# Altium schematic sheet Sheet1.SchDoc
size A4
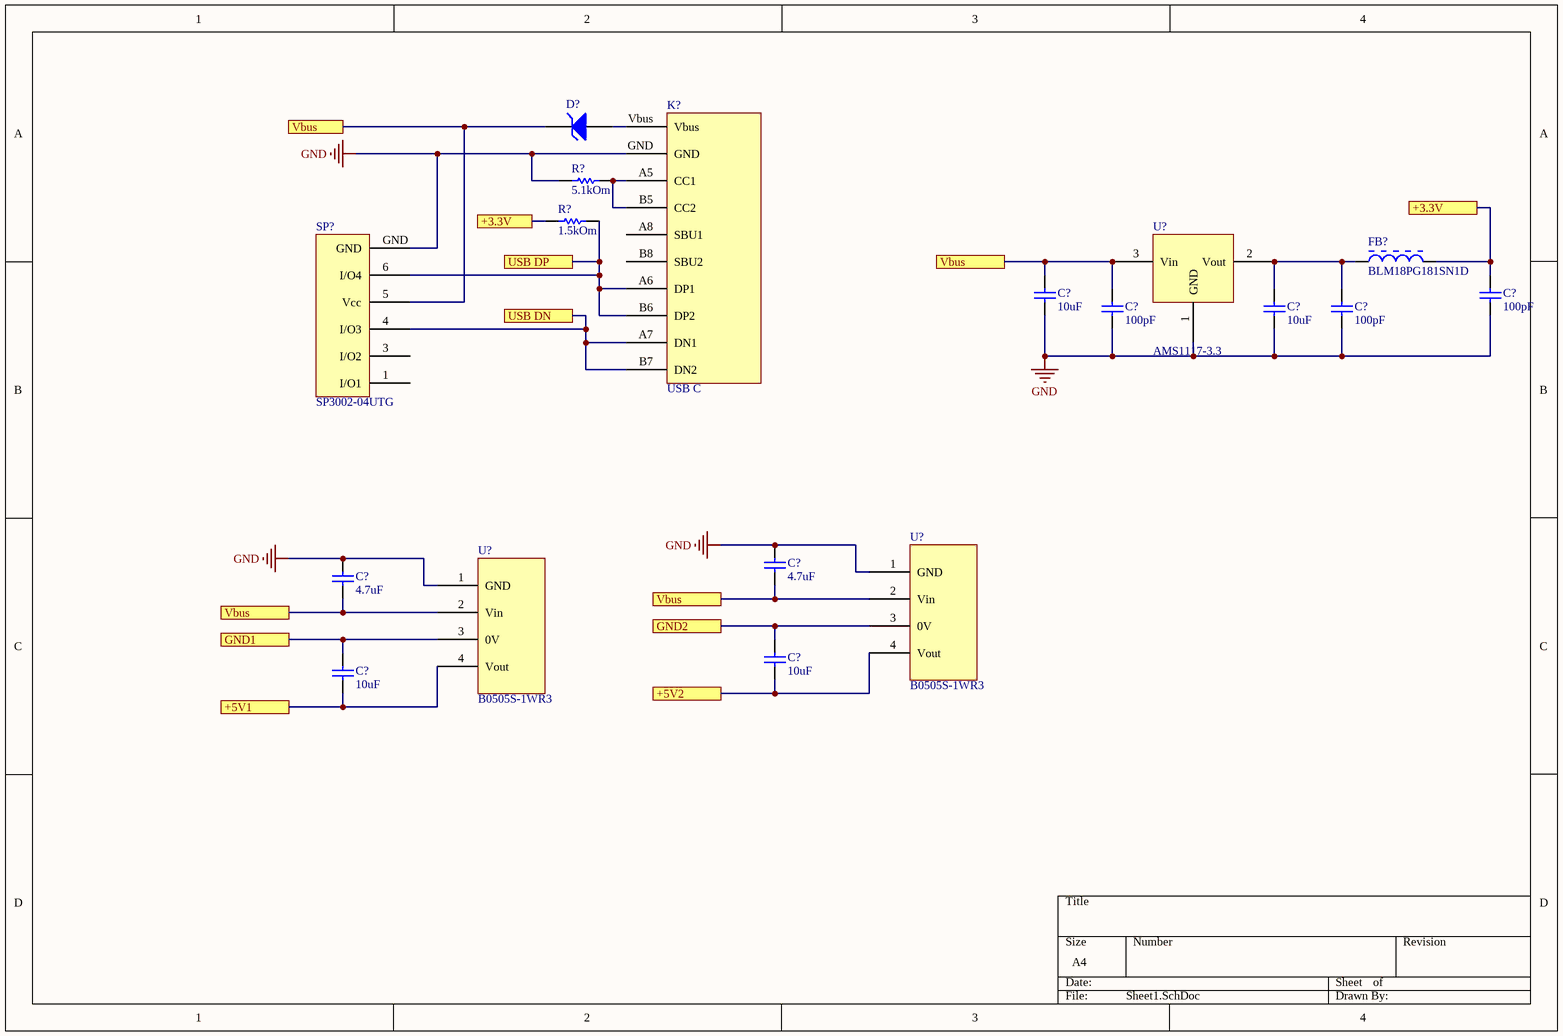
[diagram p0: Sheet1.SchDoc]

## Parts
(Parts that share a designator on the sheet are numbered #1, #2 ... from top to bottom, then left to right.)
C?#1  10uF  [CAPC1608X90X35ML10T15]
C?#2  100pF  [CAPC1608X90X35ML10T15]
C?#3  100pF  [CAPC1608X90X35ML10T15]
C?#4  10uF  [CAPC1608X90X35ML10T15]
C?#5  100pF  [CAPC1608X90X35ML10T15]
C?#6  4.7uF  [CAPC1608X90X35ML10T15]
C?#7  4.7uF  [CAPC1608X90X35ML10T15]
C?#8  10uF  [CAPC1608X90X35ML10T15]
C?#9  10uF  [CAPC1608X90X35ML10T15]
D?  (no value)  [TECO-0603_V]
FB?  BLM18PG181SN1D  [MURA-BLM18PG_KG-CHIP-2_V2]
K?  USB C  [USB type C]
R?#1  5.1kOm  [RESC1608X55X30ML20T10]
R?#2  1.5kOm  [RESC1608X55X30ML20T10]
SP?  SP3002-04UTG  [uDFN-6]
U?#1  AMS1117-3.3  [AMS1117]
U?#2  B0505S-1WR3  [Dip4 package]
U?#3  B0505S-1WR3  [Dip4 package]

## Ports
+3.3V, +5V1, +5V2, GND1, GND2, USB DN, USB DP, Vbus

## Nets
GND: C?#1.1 C?#2.1 C?#3.1 C?#4.1 C?#5.1 C?#6.2 C?#7.2 K?.GND R?#1.1 SP?.GND U?#1.1(GND) U?#2.1(GND) U?#3.1(GND)
+3.3V: C?#2.2 FB?.2 R?#2.1 ; port +3.3V
+5V1: C?#9.1 U?#3.4(Vout) ; port +5V1
+5V2: C?#8.1 U?#2.4(Vout) ; port +5V2
GND1: C?#9.2 U?#3.3(0V) ; port GND1
GND2: C?#8.2 U?#2.3(0V) ; port GND2
USB DN: K?.A7(DN1) K?.B7(DN2) SP?.4(I/O3) ; port USB DN
USB DP: K?.A6(DP1) K?.B6(DP2) R?#2.2 SP?.6(I/O4) ; port USB DP
Vbus: C?#1.2 C?#3.2 C?#6.1 C?#7.1 D?.2(K) SP?.5(Vcc) U?#1.3(Vin) U?#2.2(Vin) U?#3.2(Vin) ; port Vbus
NetC?#4_2: C?#4.2 C?#5.2 FB?.1 U?#1.2(Vout)
NetD?_1: D?.1(A) K?.Vbus
NetK?_A5: K?.A5(CC1) K?.B5(CC2) R?#1.2

Not connected (* = marked no-connect by the designer): K? A8(SBU1) B8(SBU2); SP? 1(I/O1) 3(I/O2)

## Library data of the parts
C?#1-C?#9 = CMP-2006-02335-1: Manufacturer: Murata; Part Number: GCM1885C2A101JA16D
D? = CMP-2000-06889-1: ESD Protector Overvoltage Protection Device, 0.25 pF, 24 V, -55 to 125 degC, 2-Pin SMD (0603), RoHS, Tape and Reel; Manufacturer: TE Connectivity; Capacitance Value: 0.25pF; Rad Hardened: No; Leakage Current (Max): 10uA; Clamping Voltage: 45(Typ)V; Product Height (mm): 0.55mm; Working Voltage: 24V; Product Length (mm): 1.7(Max)mm; Direction Type: Bi-Directional; Number of  Elements: 1; Product Depth (mm): 1(Max)mm; Datasheet Version: Rev. G, 11/2012; Package Reference: 0603; Operating Temperature Max Deg. C: 125C; Packaging: TapeandReel/Box; Leakage Current: 10uA; Datasheet URL: https://datasheet.ciiva.com/30563/eng-ss-scd27256-c-30563476.pdf; Mounting: SurfaceMount; Manufacturer URL: http://www.te.com/; Operating Temperature Classification: Military; Reverse Stand-off Voltage: 24V; Working Voltage (Max): 24V; Mounting Style: SurfaceMount; Operating Temperature Min Deg. C: -55C; Operating Temp Range: -55Cto125C; Pin Count: 2; Mounting Technology: SurfaceMount; Package Description: 2-Pin Surface Mount Device, Body 1.60 x 0.825 mm
FB? = CMP-0686-00566-2: Chip Ferrite Bead for Power Lines, 180 Ohm, 1500 mA, -55 to 125 degC, 1.6 x 0.8 x 0.95 mm SMD, Tape and Reel; Manufacturer: Murata; Impedance (at 100 MHz): 180 Ohm +/- 25%; Rated Current: 1500 mA; DC Resistance: 0.09 Ohm Max.; ComponentLink3Description: Package Specification; PackageDescription: 2-Pin Chip, Body 1.6 x 0.8 mm; Mounting Technology: Surface Mount; ComponentLink1Description: Manufacturer URL; Operating Temperature Range: -55 to 125 degC; Packing: Tape and Reel; DatasheetVersion: 08/2013; ComponentLink3URL: http://www.murata.com/products/catalog/pdf/c31e.pdf; ComponentLink2Description: Datasheet; PartNumber: BLM18PG181SN1D; ComponentLink1URL: http://www.murata.com/; ComponentLink2URL: http://www.murata.com/products/catalog/pdf/c31e.pdf; PackageReference: BLM18_H950-2
R?#1 R?#2 = CMP-2000-01555-1: Part Number: RK73H1JTTD5101F; Manufacturer: KOA Speer
SP? = SP3002-04UTG: ComponentLink1Description: New link; ComponentLink1URL: https://lcsc.com/product-detail/Others_Littelfuse_SP3002-04UTG_Littelfuse-SP3002-04UTG_C207277.html
U?#2 U?#3 = B0505S-1WR3: ComponentLink1Description: New link; ComponentLink1URL: https://lcsc.com/product-detail/Power-Modules_B0505S-1WR3_C131038.html